# Altium schematic sheet MCU.SchDoc
size A3; SheetNumber: 2; SheetTotal: 3; SPICEModelCacheELPNFJPW: <root> / <DocumentId>ELPNFJPW</DocumentId> / <CacheFrame Number="0"> / <Model Name="0603_150060rs75003" Kind="CKT"> / <Text>****** / .subckt 0603_150060RS75003  1  2 / D1 1 2 SMCW / .MODEL SMCW D / + IS=1.0025E-15 / + N=2.2259 / + RS=.3926 / + IKF=240.91E-6 / + CJO=1.0000E-12 / + M=.3333 / + VJ=.75 / + BV=5 / + IBV=10.00E-6 / + TT=5.0000E-9 / .ends</Text> / </Model> / <Model Name="0603_150060vs55040" Kind="CKT"> / <Text>***************************** / .subckt 0603_150060VS55040 1 2 / D1 1 2 SMCD / .MODEL SMCD D / + IS=135.21E-15 / + N=2.0992 / + RS=1.0413 / + IKF=173.47E-9 / + CJO=1.0000E-12 / + M=.3333 / + VJ=.75 / + BV=5 / + IBV=100.00E-6 / + TT=5.0000E-9 / .ends</Text> / </Model> / <Model Name="0603_150060ys55040" Kind="CKT"> / <Text>***************************** / .subckt 0603_150060YS55040 1 2 / D1 1 2 SMCD / .MODEL SMCD D / + IS=135.21E-15 / + N=2.0992 / + RS=1.0413 / + IKF=173.47E-9 / + CJO=1.0000E-12 / + M=.3333 / + VJ=.75 / + BV=5 / + IBV=100.00E-6 / + TT=5.0000E-9 / .ends</Text> / </Model> / <Model Name="0603_150060bs75020" Kind="CKT"> / <Text>****** / .subckt 0603_150060BS75020  1  2 / D1 1 2 SMCW / .MODEL SMCW D / + IS=7.6676E-9 / + N=5 / + RS=2.6261 / + IKF=1.3194E-6 / + CJO=1.0000E-12 / + M=.3333 / + VJ=.75 / + BV=5 / + IBV=10.00E-6 / + TT=5.0000E-9 / .ends</Text> / </Model> / </CacheFrame> / </root>
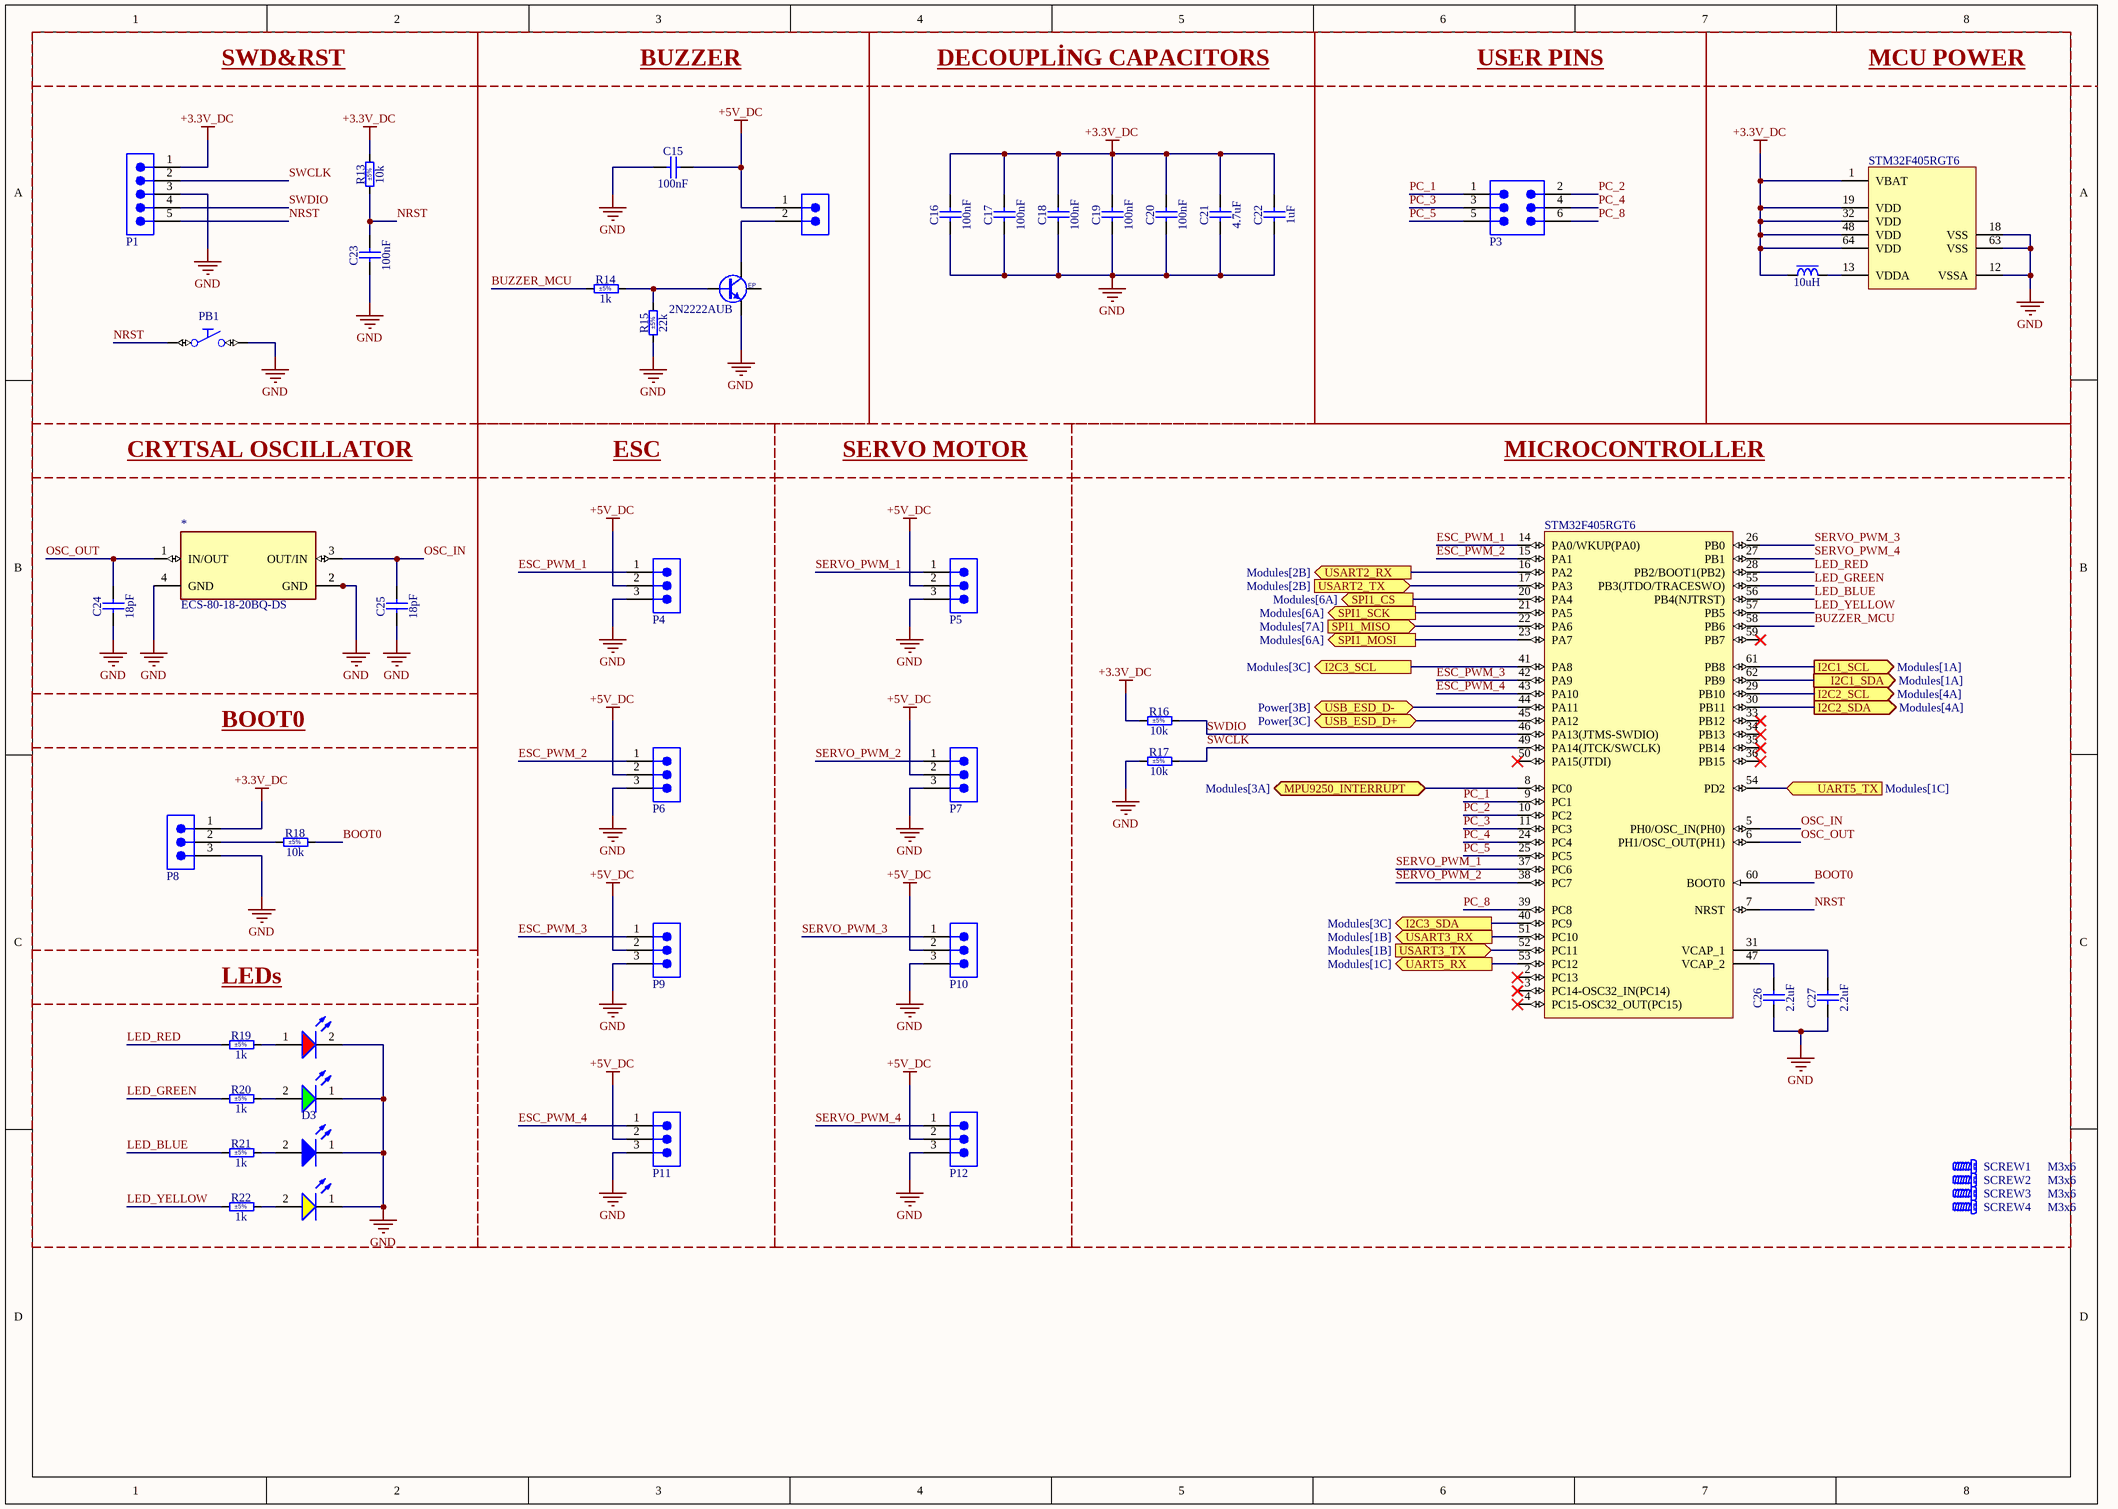
[diagram p0: MCU.SchDoc]

## Parts
*  ECS-80-18-20BQ-DS  [ECS-80-18-20BQ-DS]
C15  100nF  [CAPC2012X135N]
C16  100nF  [CAPC2012X135N]
C17  100nF  [CAPC2012X135N]
C18  100nF  [CAPC2012X135N]
C19  100nF  [CAPC2012X135N]
C20  100nF  [CAPC2012X135N]
C21  4.7uF  [CAPC2012X135N]
C22  1uF  [CAPC2012X145N]
C23  100nF  [CAPC2012X135N]
C24  18pF  [CAPC2012X135N]
C25  18pF  [CAPC2012X135N]
C26  2.2uF  [CAPC2012X135N]
C27  2.2uF  [CAPC2012X135N]
D3  Blue, 3.2V, 140°  [WL-SMCW_0603_150060xx75020]  (value not drawn)
D5  Red, 2V, 140°  [WL-SMCW_0603_150060xx75003]  (value not drawn)
D6  Bright Green, 2V, 140°  [WL-SMCD_0603]  (value not drawn)
D8  Yellow, 2V, 140°  [WL-SMCD_0603]  (value not drawn)
IC1  STM32F405RGT6  [QFP50P1200X1200X160-64N]  (parts A,B of 2)
L3  10uH  [IND_MURATA-PS_8200]
P1  61300511121  [61300511121]  (value not drawn)
P2  691322310002  [691322310002]  (value not drawn)
P3  61300621121  [61300621121]  (value not drawn)
P4  61300311121  [61300311121]  (value not drawn)
P5  61300311121  [61300311121]  (value not drawn)
P6  61300311121  [61300311121]  (value not drawn)
P7  61300311121  [61300311121]  (value not drawn)
P8  61300311121  [61300311121]  (value not drawn)
P9  61300311121  [61300311121]  (value not drawn)
P10  61300311121  [61300311121]  (value not drawn)
P11  61300311121  [61300311121]  (value not drawn)
P12  61300311121  [61300311121]  (value not drawn)
PB1  Push Button  [PB_C&K_KSR2xxGLF]  (value not drawn)
R13  10k  Tolerance: ±5%  [RESC2012X60N]
R14  1k  Tolerance: ±5%  [RESC2012X60N]
R15  22k  Tolerance: ±5%  [RESC2012X60N]
R16  10k  Tolerance: ±5%  [RESC2012X60N]
R17  10k  Tolerance: ±5%  [RESC2012X60N]
R18  10k  Tolerance: ±5%  [RESC2012X60N]
R19  1k  Tolerance: ±5%  [RESC2012X60N]
R20  1k  Tolerance: ±5%  [RESC2012X60N]
R21  1k  Tolerance: ±5%  [RESC2012X60N]
R22  1k  Tolerance: ±5%  [RESC2012X60N]
SCREW1  M3x6  [BOSSARD_BN5687-3061605_v]
SCREW2  M3x6  [BOSSARD_BN5687-3061605_v]
SCREW3  M3x6  [BOSSARD_BN5687-3061605_v]
SCREW4  M3x6  [BOSSARD_BN5687-3061605_v]
T1  2N2222AUB  [MICROSEMI_UB]

## Blocks framed on the sheet
SWD&RST: C23 P1 PB1 R13
BUZZER: C15 P2 R14 R15 T1
DECOUPLİNG CAPACITORS: C16-C22
USER PINS: P3
MCU POWER: IC1 L3
CRYTSAL OSCILLATOR: * C24 C25
ESC: P4 P6 P9 P11
SERVO MOTOR: P5 P7 P10 P12
MICROCONTROLLER: C26 C27 IC1 R16 R17 SCREW1-SCREW4
BOOT0: P8 R18
LEDs: D3 D5 D6 D8 R19-R22

## Ports
I2C1_SCL (out, see Modules[1A]), I2C1_SDA (out, see Modules[1A]), I2C2_SCL (out, see Modules[4A]), I2C2_SDA (out, see Modules[4A]), I2C3_SCL (out, see Modules[3C]), I2C3_SDA (out, see Modules[3C]), MPU9250_INTERRUPT (bidir, see Modules[3A]), SPI1_CS (out, see Modules[6A]), SPI1_MISO (in, see Modules[7A]), SPI1_MOSI (out, see Modules[6A]), SPI1_SCK (out, see Modules[6A]), UART5_RX (out, see Modules[1C]), UART5_TX (in, see Modules[1C]), USART2_RX (out, see Modules[2B]), USART2_TX (in, see Modules[2B]), USART3_RX (out, see Modules[1B]), USART3_TX (in, see Modules[1B]), USB_ESD_D+ (bidir, see Power[3C]), USB_ESD_D- (bidir, see Power[3B])

## Nets
+3.3V_DC: C16.2 C17.2 C18.2 C19.2 C20.2 C21.2 C22.2 IC1.1(VBAT) IC1.19(VDD) IC1.32(VDD) IC1.48(VDD) IC1.64(VDD) L3.1 P1.1 P8.1 R13.2 R16.1
+5V_DC: C15.2 P2.1 P4.2 P5.2 P6.2 P7.2 P9.2 P10.2 P11.2 P12.2
GND: *.2(GND) *.4(GND) C15.1 C16.1 C17.1 C18.1 C19.1 C20.1 C21.1 C22.1 C23.1 C24.1 C25.1 C26.1 C27.1 D3.1(K) D5.2(K) D6.1(K) D8.1(K) IC1.12(VSSA) IC1.18(VSS) IC1.63(VSS) P1.3 P4.3 P5.3 P6.3 P7.3 P8.3 P9.3 P10.3 P11.3 P12.3 PB1.2(NO) R15.1 R17.1 T1.2(E)
BOOT0: IC1.60(BOOT0) R18.2
BUZZER_MCU: IC1.58(PB6) R14.1
ESC_PWM_1: IC1.14(PA0/WKUP(PA0)) P4.1
ESC_PWM_2: IC1.15(PA1) P6.1
ESC_PWM_3: IC1.42(PA9) P9.1
ESC_PWM_4: IC1.43(PA10) P11.1
I2C1_SCL: IC1.61(PB8) ; port I2C1_SCL
I2C1_SDA: IC1.62(PB9) ; port I2C1_SDA
I2C2_SCL: IC1.29(PB10) ; port I2C2_SCL
I2C2_SDA: IC1.30(PB11) ; port I2C2_SDA
I2C3_SCL: IC1.41(PA8) ; port I2C3_SCL
I2C3_SDA: IC1.40(PC9) ; port I2C3_SDA
LED_BLUE: IC1.56(PB4(NJTRST)) R21.1
LED_GREEN: IC1.55(PB3(JTDO/TRACESWO)) R20.1
LED_RED: IC1.28(PB2/BOOT1(PB2)) R19.1
LED_YELLOW: IC1.57(PB5) R22.1
MPU9250_INTERRUPT: IC1.8(PC0) ; port MPU9250_INTERRUPT
NRST: C23.2 IC1.7(NRST) P1.5 PB1.1(C) R13.1
OSC_IN: *.3(OUT/IN) C25.2 IC1.5(PH0/OSC_IN(PH0))
OSC_OUT: *.1(IN/OUT) C24.2 IC1.6(PH1/OSC_OUT(PH1))
PC_1: IC1.9(PC1) P3.1
PC_2: IC1.10(PC2) P3.2
PC_3: IC1.11(PC3) P3.3
PC_4: IC1.24(PC4) P3.4
PC_5: IC1.25(PC5) P3.5
PC_8: IC1.39(PC8) P3.6
SERVO_PWM_1: IC1.37(PC6) P5.1
SERVO_PWM_2: IC1.38(PC7) P7.1
SERVO_PWM_3: IC1.26(PB0) P10.1
SERVO_PWM_4: IC1.27(PB1) P12.1
SPI1_CS: IC1.20(PA4) ; port SPI1_CS
SPI1_MISO: IC1.22(PA6) ; port SPI1_MISO
SPI1_MOSI: IC1.23(PA7) ; port SPI1_MOSI
SPI1_SCK: IC1.21(PA5) ; port SPI1_SCK
SWCLK: IC1.49(PA14(JTCK/SWCLK)) P1.2 R17.2
SWDIO: IC1.46(PA13(JTMS-SWDIO)) P1.4 R16.2
UART5_RX: IC1.53(PC12) ; port UART5_RX
UART5_TX: IC1.54(PD2) ; port UART5_TX
USART2_RX: IC1.16(PA2) ; port USART2_RX
USART2_TX: IC1.17(PA3) ; port USART2_TX
USART3_RX: IC1.51(PC10) ; port USART3_RX
USART3_TX: IC1.52(PC11) ; port USART3_TX
USB_ESD_D+: IC1.45(PA12) ; port USB_ESD_D+
USB_ESD_D-: IC1.44(PA11) ; port USB_ESD_D-
NetC26_2: C26.2 IC1.47(VCAP_2)
NetC27_2: C27.2 IC1.31(VCAP_1)
NetD3_2: D3.2(A) R21.2
NetD5_1: D5.1(A) R19.2
NetD6_2: D6.2(A) R20.2
NetD8_2: D8.2(A) R22.2
NetIC1_13: IC1.13(VDDA) L3.2
NetP2_2: P2.2 T1.3(C)
NetP8_2: P8.2 R18.1
NetR14_2: R14.2 R15.2 T1.1(B)

Not connected (* = marked no-connect by the designer): IC1 2(PC13)* 3(PC14-OSC32_IN(PC14))* 4(PC15-OSC32_OUT(PC15))* 33(PB12)* 34(PB13)* 35(PB14)* 36(PB15)* 50(PA15(JTDI))* 59(PB7)*; T1 4(EP)

## Library data of the parts
C15-C20 C23 = CC0805_100NF_50V_10%_X7R: Non-polarised capacitor; Part Description: SMD Multilayer Chip Ceramic Capacitor; Manufacturer: GENERIC; Manufacturer1 Part Number: C2012X7R1H104K085; Voltage: 50V; TC: X7R; Tolerance: ±10%; Part Number: CC0805_100NF_50V_10%_X7R; Component Kind: Standard; Component Type: Standard; Pin Count: 2; Value: 100nF; Status: None; Manufacturer Part Number: CC0805_100NF_50V_10%_X7R; Case: 0805; Mounted: Yes; Socket: No; SMD: Yes; Sense: No; Manufacturer1 Example: TDK; Manufacturer1 ComponentHeight: 1mm; HelpURL: \\cern.ch\dfs\Applications\Altium\Datasheets\CC0805_X7R_TDK_C.pdf; Author: CERN DEM JLC; CreateDate: 3.12.2007; LatestRevisionDate: 22.04.2015
C21 = CC0805_4.7UF_10V_10%_X5R: Non-polarised capacitor; Part Description: SMD Multilayer Chip Ceramic Capacitor; Manufacturer: GENERIC; Manufacturer1 Part Number: 222224013672; Voltage: 10V; TC: X5R; Tolerance: ±10%; Part Number: CC0805_4.7UF_10V_10%_X5R; Component Kind: Standard; Component Type: Standard; Pin Count: 2; Value: 4.7uF; Status: Preferred; Manufacturer Part Number: CC0805_4.7UF_10V_10%_X5R; Case: 0805; Mounted: Yes; Socket: No; SMD: Yes; Sense: No; Manufacturer1 Example: PHYCOMP; Manufacturer1 ComponentHeight: 1.45mm; HelpURL: \\cern.ch\dfs\Applications\Altium\Datasheets\CC0805_X5R_PHYCOMP_HC.pdf; Author: CERN DEM JLC; CreateDate: 3.12.2007; LatestRevisionDate: 3.12.2007
C22 = CC0805_1UF_100V_10%_X7S_YUDEN_HMK212BC7105KGHTE: Non-polarised capacitor; Part Description: SMD Multilayer Chip Ceramic Capacitor for Automotive / Industrial Applications; Manufacturer: TAIYO YUDEN; Voltage: 100V; TC: X7S; Tolerance: ±10%; Part Number: CC0805_1UF_100V_10%_X7S_YUDEN_HMK212BC7105KGHTE; Component Kind: Standard; Component Type: Standard; Pin Count: 2; Value: 1uF; Status: Not Recommended; Manufacturer Part Number: HMK212BC7105KGHTE; Case: 0805; Mounted: Yes; Socket: No; SMD: Yes; Sense: No; ComponentHeight: 1.45mm; HelpURL: \\cern.ch\dfs\Applications\Altium\Datasheets\CC0805_TAIYO-YUDEN_HMK212BC7105KGHTE.pdf; Author: CERN DEM JLC; CreateDate: 9.05.2017; LatestRevisionDate: 9.05.2017
C24 C25 = CC0805_18PF_50V_5%_NP0: Non-polarised capacitor; Part Description: SMD Multilayer Chip Ceramic Capacitor; Manufacturer: GENERIC; Manufacturer1 Part Number: 223886115189; Voltage: 50V; TC: C0G/NP0; Tolerance: ±5%; Part Number: CC0805_18PF_50V_5%_NP0; Component Kind: Standard; Component Type: Standard; Pin Count: 2; Value: 18pF; Status: Preferred; Manufacturer Part Number: CC0805_18PF_50V_5%_NP0; Case: 0805; Mounted: Yes; Socket: No; SMD: Yes; Sense: No; Manufacturer1 Example: PHYCOMP; Manufacturer1 ComponentHeight: 1.35mm; HelpURL: \\cern.ch\dfs\Applications\Altium\Datasheets\CC0805_NP0_PHYCOMP.pdf; Author: CERN DEM JLC; CreateDate: 3.12.2007; LatestRevisionDate: 3.12.2007
C26 C27 = CC0805_2.2UF_16V_10%_X7R: Non-polarised capacitor; Part Description: SMD Multilayer Chip Ceramic Capacitor; Manufacturer: GENERIC; Manufacturer1 Part Number: GRM21BF51C225ZA01L; Voltage: 16V; TC: X7R; Tolerance: ±10%; Part Number: CC0805_2.2UF_16V_10%_X7R; Component Kind: Standard; Component Type: Standard; Pin Count: 2; Value: 2.2uF; Status: Preferred; Manufacturer Part Number: CC0805_2.2UF_16V_10%_X7R; Case: 0805; Mounted: Yes; Socket: No; SMD: Yes; Sense: No; Manufacturer1 Example: MURATA; Manufacturer1 ComponentHeight: 1.5mm; HelpURL: \\cern.ch\dfs\Applications\Altium\Datasheets\CC0805_X7R_MURATA_GRM.pdf; Author: CERN DEM JLC; CreateDate: 3.12.2007; LatestRevisionDate: 18.09.2014
D3 = 150060BS75020: WL-SMCW Mono-color Chip LED Waterclear, size 0603, Blue, 3.2V, 140°; Manufacturer: Wurth Elektronik; Case/Size Code: 0603; Chip Technology: InGaN; Dominant Wavelength: 470nm; Luminous Intensity: 150mcd; Peak Wavelength: 465nm; Manufacturer Part Number: 150060BS75020; Category: Signal LEDs; Match Code: WL-SMCW; ComponentLink1Description: Website Link; ComponentLink1URL: https://www.we-online.com/redexpert/article/150060BS75020?ad; ComponentLink2Description: Datasheet Link; ComponentLink2URL: https://www.we-online.com/redexpert/spec/150060BS75020?ad; Mount: Surface Mount; Operating Temperature Max: 85°C; Operating Temperature Min: -40°C; Packaging: Tape and Reel; Length: 1.6mm; Width: 0.8mm; Height: 0.25mm; Emitting Color: Blue; Forward Voltage: 3.2V; Viewing Angle: 140°
D5 = 150060RS75003: WL-SMCW Mono-color Chip LED Waterclear, size 0603, Red, 2V, 140°; Manufacturer: Wurth Elektronik; Case/Size Code: 0603; Chip Technology: AlInGaP; Dominant Wavelength: 625nm; Luminous Intensity: 530mcd; Peak Wavelength: 630nm; Manufacturer Part Number: 150060RS75003; Category: Signal LEDs; Match Code: WL-SMCW; ComponentLink1Description: Website Link; ComponentLink1URL: https://www.we-online.com/redexpert/article/150060RS75003?ad; ComponentLink2Description: Datasheet Link; ComponentLink2URL: https://www.we-online.com/redexpert/spec/150060RS75003?ad; Mount: Surface Mount; Operating Temperature Max: 100°C; Operating Temperature Min: -40°C; Packaging: Tape and Reel; Length: 1.6mm; Width: 0.8mm; Height: 0.7mm; Emitting Color: Red; Forward Voltage: 2V; Viewing Angle: 140°
D6 = 150060VS55040: WL-SMCD Mono-color Chip LED Diffused, SMT, size 0603, Bright Green, 2V, 140°; Manufacturer: Wurth Elektronik; Case/Size Code: 0603; Chip Technology: AlInGaP; Dominant Wavelength: 573nm; Luminous Intensity: 60mcd; Peak Wavelength: 575nm; Manufacturer Part Number: 150060VS55040; Category: Signal LEDs; Match Code: WL-SMCD; ComponentLink1Description: Website Link; ComponentLink1URL: https://www.we-online.com/redexpert/article/150060VS55040?ad; ComponentLink2Description: Datasheet Link; ComponentLink2URL: https://www.we-online.com/redexpert/spec/150060VS55040?ad; Mount: Surface Mount; Operating Temperature Max: 85°C; Operating Temperature Min: -40°C; Packaging: Tape and Reel; Length: 1.6mm; Width: 0.8mm; Height: 0.4mm; Emitting Color: Bright Green; Forward Voltage: 2V; Viewing Angle: 140°
D8 = 150060YS55040: WL-SMCD Mono-color Chip LED Diffused, SMT, size 0603, Yellow, 2V, 140°; Manufacturer: Wurth Elektronik; Case/Size Code: 0603; Chip Technology: AlInGaP; Dominant Wavelength: 589nm; Luminous Intensity: 100mcd; Peak Wavelength: 591nm; Manufacturer Part Number: 150060YS55040; Category: Signal LEDs; Match Code: WL-SMCD; ComponentLink1Description: Website Link; ComponentLink1URL: https://www.we-online.com/redexpert/article/150060YS55040?ad; ComponentLink2Description: Datasheet Link; ComponentLink2URL: https://www.we-online.com/redexpert/spec/150060YS55040?ad; Mount: Surface Mount; Operating Temperature Max: 85°C; Operating Temperature Min: -40°C; Packaging: Tape and Reel; Length: 1.6mm; Width: 0.8mm; Height: 0.4mm; Emitting Color: Yellow; Forward Voltage: 2V; Viewing Angle: 140°
IC1 = STM32F405RGT6: ARM Cortex-M4 32-bit MCU+FPU, 210DMIPS, 1024kB Flash, 192kB+4kB RAM, 51 I/Os, 64-pin LQFP, Industrial Grade –40 to 85°C; Part Description: ARM Cortex-M4 32-bit MCU+FPU, 210DMIPS, 1024KB Flash, 192+4 KB RAM, 51 I/Os, 64-pin LQFP, Industrial Grade –40 to 85°C; Manufacturer: ST MICROELECTRONICS; PressFit: No; Bonding: No; Part Number: STM32F405RGT6; Component Kind: Standard; Component Type: Standard; Device: STM32F405RGT6; PackageDescription: QFP, 0.50mm Pitch, Square; 64 Pin, 10.0mm L X 10.0mm W X 1.60mm H body, IPC Medium Density; Manufacturer Part Number: STM32F405RGT6; Pin Count: 64; Case: QFP64; Mounted: Yes; Socket: No; SMD: Yes; Sense: No; ComponentHeight: 1.6mm; HelpURL: \\cern.ch\dfs\Applications\Altium\Datasheets\STM32F405RGT6.pdf; Author: CERN DEM JLC; CreateDate: 20.06.2017; LatestRevisionDate: 20.06.2017
L3 = IND_10UH_10%_MURATA-PS_8200: Inductor With Core; Part Description: Miniature Surface Mount Power Inductor (8200 Series); Manufacturer: MURATA POWER SOLUTIONS; Manufacturer Part Number: 82103C; Power: 500mA; Resistance: 0.4R; Tolerance: ±10%; Part Number: IND_10UH_10%_MURATA-PS_8200; Component Kind: Standard; Component Type: Standard; Pin Count: 2; Value: 10uH; Mounted: Yes; Socket: No; SMD: Yes; Sense: No; ComponentHeight: 2.3mm; HelpURL: \\cern.ch\dfs\Applications\Altium\Datasheets\IND_MURATA-PS_8200.pdf; Author: CERN DEM JLC; CreateDate: 21.07.2014; LatestRevisionDate: 21.07.2014
P1 = 61300511121: WR-PHD Pin Header, THT, Vertical, pitch 2.54mm, 1 Row, 5P; Manufacturer: Wurth Elektronik; Contact Resistance: 20mOhm; Rated Current: 3A; Working Voltage: 250V; Withstanding Voltage: 500V; Manufacturer Part Number: 61300511121; Category: Board-to-Board Connectors; Match Code: WR-PHD; ComponentLink1Description: Website Link; ComponentLink1URL: https://www.we-online.com/redexpert/article/61300511121?ad; ComponentLink2Description: Datasheet Link; ComponentLink2URL: https://www.we-online.com/redexpert/spec/61300511121?ad; Mount: Through Hole; Operating Temperature Max: 105°C; Operating Temperature Min: -40°C; Packaging: Bag; Gender: Pin Header; Number of Pins: 5; Number of Rows: 1; Orientation: Vertical; Pitch: 2.54mm
P2 = 691322310002: WR-TBL Series 322 Horizontal PCB Header, THT, pitch 3.81mm, 2p; Manufacturer: Wurth Elektronik; Modularity: No; Rated Current: 10A; Working Voltage: 300V; Manufacturer Part Number: 691322310002; Category: Terminal Blocks; Match Code: WR-TBL; ComponentLink1Description: Website Link; ComponentLink1URL: https://www.we-online.com/redexpert/article/691322310002?ad; ComponentLink2Description: Datasheet Link; ComponentLink2URL: https://www.we-online.com/redexpert/spec/691322310002?ad; Mount: Through Hole; Operating Temperature Max: 105°C; Operating Temperature Min: -40°C; Packaging: Box; Application: Pluggable; Number of Pins: 2; Number of Rows: 1; Orientation: Horizontal; Pitch: 3.81mm
P3 = 61300621121: WR-PHD Pin Header, THT, Vertical, pitch 2.54mm, 2 Row, 6P; Manufacturer: Wurth Elektronik; Contact Resistance: 20mOhm; Rated Current: 3A; Working Voltage: 250V; Withstanding Voltage: 500V; Manufacturer Part Number: 61300621121; Category: Board-to-Board Connectors; Match Code: WR-PHD; ComponentLink1Description: Website Link; ComponentLink1URL: https://www.we-online.com/redexpert/article/61300621121?ad; ComponentLink2Description: Datasheet Link; ComponentLink2URL: https://www.we-online.com/redexpert/spec/61300621121?ad; Mount: Through Hole; Operating Temperature Max: 105°C; Operating Temperature Min: -40°C; Packaging: Bag; Gender: Pin Header; Number of Pins: 6; Number of Rows: 2; Orientation: Vertical; Pitch: 2.54mm
P4-P12 = 61300311121: WR-PHD Pin Header, THT, Vertical, pitch 2.54mm, 1 Row, 3P; Manufacturer: Wurth Elektronik; Contact Resistance: 20mOhm; Rated Current: 3A; Working Voltage: 250V; Withstanding Voltage: 500V; Manufacturer Part Number: 61300311121; Category: Board-to-Board Connectors; Match Code: WR-PHD; ComponentLink1Description: Website Link; ComponentLink1URL: https://www.we-online.com/redexpert/article/61300311121?ad; ComponentLink2Description: Datasheet Link; ComponentLink2URL: https://www.we-online.com/redexpert/spec/61300311121?ad; Mount: Through Hole; Operating Temperature Max: 105°C; Operating Temperature Min: -40°C; Packaging: Bag; Gender: Pin Header; Number of Pins: 3; Number of Rows: 1; Orientation: Vertical; Pitch: 2.54mm
PB1 = PB_C&K_KSR223GLFG: Push-Button Switch SPST; Part Description: 32VDC 10mA SPST-NO Surface Mount Subminiature Tact Momentary Pushbutton Switch, Operating Force 2N; Manufacturer: C&K; PressFit: No; Sense Comment: Non-washable; Part Number: PB_C&K_KSR223GLFG; Component Kind: Standard; Component Type: Standard; Pin Count: 2; PackageDescription: Body 7.3x3.8mm, Surface Mount Subminiature Tact Switch, C&K KSR Series; Family: Push Button; Mounted: Yes; Socket: No; SMD: Yes; Sense: Yes; Status: None; Manufacturer Part Number: KSR223GLFG; ComponentHeight: 2.5mm; HelpURL: \\cern.ch\dfs\Applications\Altium\Datasheets\PB_C&K_KSR-Series.pdf; Author: CERN DEM HF; CreateDate: 5.10.2021; LatestRevisionDate: 5.10.2021
R13 R16 R17 = R0805_10K_0.1%_0.1W_10PPM: Resistor - 0.1%; Part Description: Thin Film Chip Resistor; Manufacturer: GENERIC; Manufacturer1 Part Number: RN73C2A10KBTG; Power: 0.1W; TC: ±10ppm; PressFit: No; Part Number: R0805_10K_0.1%_0.1W_10PPM; Component Kind: Standard; Component Type: Standard; Pin Count: 2; Value: 10k; Status: Not Recommended; Manufacturer Part Number: R0805_10K_0.1%_0.1W_10PPM; Case: 0805; Mounted: Yes; Sense: No; Socket: No; SMD: Yes; Manufacturer1 Example: TYCO HOLSWORTHY; Manufacturer1 ComponentHeight: 0.6mm; HelpURL: \\cern.ch\dfs\Applications\Altium\Datasheets\R0805_Tyco_RN73.pdf; Author: CERN DEM JLC; CreateDate: 3.12.2007; LatestRevisionDate: 13.03.2008
R14 R19-R22 = R0805_1K_0.1%_0.125W_25PPM: Resistor - 0.1%; Part Description: Thin Film Chip Resistor; Manufacturer: GENERIC; Manufacturer1 Part Number: ERA6AEB102V; Power: 0.125W; TC: ±25ppm; PressFit: No; Part Number: R0805_1K_0.1%_0.125W_25PPM; Component Kind: Standard; Component Type: Standard; Pin Count: 2; Value: 1k; Status: Not Recommended; Manufacturer Part Number: R0805_1K_0.1%_0.125W_25PPM; Case: 0805; Mounted: Yes; Sense: No; Socket: No; SMD: Yes; Manufacturer1 Example: PANASONIC; Manufacturer1 ComponentHeight: 0.6mm; HelpURL: \\cern.ch\dfs\Applications\Altium\Datasheets\R0805_PANASONIC_ERA.pdf; Author: CERN DEM JLC; CreateDate: 18.10.2010; LatestRevisionDate: 18.10.2010
R15 = R0805_22K_1%_0.125W_100PPM: Resistor - 1%; Part Description: General Purpose Thick Film Chip Resistor; Manufacturer: GENERIC; Manufacturer1 Part Number: NRC10F2202TRF; Power: 0.125W; TC: ±100ppm/°C; PressFit: No; Part Number: R0805_22K_1%_0.125W_100PPM; Component Kind: Standard; Component Type: Standard; Pin Count: 2; Value: 22k; Status: Preferred; Manufacturer Part Number: R0805_22K_1%_0.125W_100PPM; Case: 0805; Mounted: Yes; Sense: No; Socket: No; SMD: Yes; Manufacturer1 Example: NIC COMPONENT; Manufacturer1 ComponentHeight: 0.6mm; HelpURL: \\cern.ch\dfs\Applications\Altium\Datasheets\R0805_NIC_NRC.pdf; Author: CERN DEM JLC; CreateDate: 3.12.2007; LatestRevisionDate: 13.03.2008
R18 = R0805_100K_1%_0.125W_100PPM: Resistor - 1%; Part Description: General Purpose Thick Film Chip Resistor; Manufacturer: GENERIC; Manufacturer1 Part Number: NRC10F1003TRF; Value: 100k; Power: 0.125W; TC: ±100ppm/°C; PressFit: No; Part Number: R0805_100K_1%_0.125W_100PPM; Component Kind: Standard; Component Type: Standard; Pin Count: 2; Status: Preferred; Manufacturer Part Number: R0805_100K_1%_0.125W_100PPM; Case: 0805; Mounted: Yes; Sense: No; Socket: No; SMD: Yes; Manufacturer1 Example: NIC COMPONENT; Manufacturer1 ComponentHeight: 0.6mm; HelpURL: \\cern.ch\dfs\Applications\Altium\Datasheets\R0805_NIC_NRC.pdf; Author: CERN DEM JLC; CreateDate: 3.12.2007; LatestRevisionDate: 13.03.2008
SCREW1-SCREW4 = BOSSARD_BN5687-3061605_v: Screw; Part Description: M3 L=6mm Hexalobular Socket Pan Head Screw, Fully Threaded, Stainless Steel A2; Manufacturer Part Number: BN5687 Art.3061605; PressFit: No; Part Number: BOSSARD_BN5687-3061605_v; Component Kind: Standard; Component Type: Mechanical; Pin Count: 0; PackageDescription: M3 L=6mm Hexalobular Socket Pan Head Screw, Fully Threaded - Stainless Steel A2; Mounted: Yes; Socket: No; SMD: No; Sense: No; Status: None; Value: M3x6; Manufacturer: BOSSARD; ComponentHeight: 2.4mm; HelpURL: \\cern.ch\dfs\Applications\Altium\Datasheets\BOSSARD_BN5687-3061605.pdf; Author: CERN DEM JLC; CreateDate: 15.01.2013; LatestRevisionDate: 15.01.2013
T1 = 2N2222AUB: NPN Transistor + Exposed Pad; Part Description: 50V 800mA NPN Silicon Switching Transistor; Manufacturer: MICROSEMI; PressFit: No; Bonding: No; Part Number: 2N2222AUB; Component Kind: Standard; Component Type: Standard; Device: 2N2222AUB; PackageDescription: MICROSEMI UB Case, 2.45mm L x 3.08mm W 1.42mm H body; Manufacturer Part Number: 2N2222AUB; Pin Count: 4; Mounted: Yes; Socket: No; SMD: Yes; Sense: No; ComponentHeight: 1.42mm; HelpURL: \\cern.ch\dfs\Applications\Altium\Datasheets\2N2222AUB.pdf; Author: CERN DEM BC; CreateDate: 28.05.2020; LatestRevisionDate: 28.05.2020